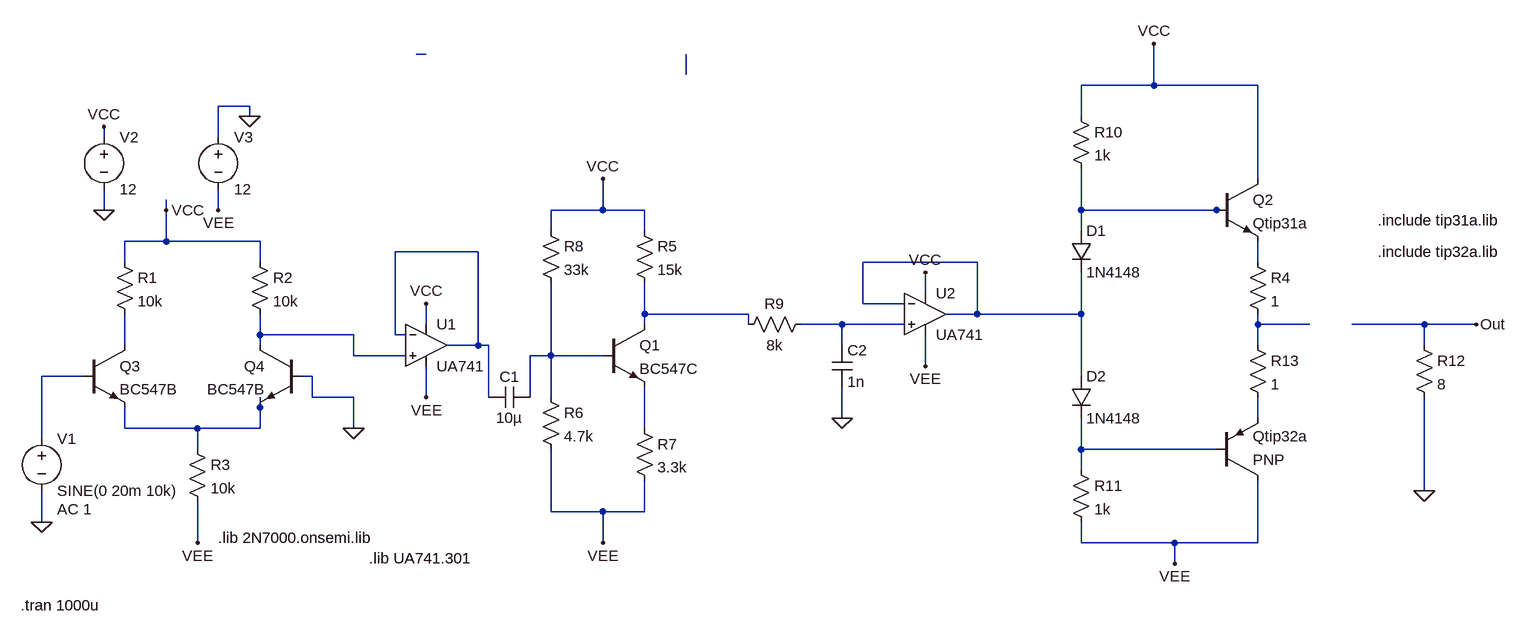
[diagram p0: schematic Audio_amp.asc]
Audio_amp.asc, the LTspice schematic file:
Version 4
SHEET 1 2476 680
WIRE 576 -320 560 -320
WIRE 976 -288 976 -320
WIRE 1696 -272 1696 -336
WIRE 1696 -272 1584 -272
WIRE 1856 -272 1696 -272
WIRE 304 -240 256 -240
WIRE 304 -224 304 -240
WIRE 1584 -224 1584 -272
WIRE 80 -192 80 -208
WIRE 256 -192 256 -240
WIRE 1856 -128 1856 -272
WIRE 80 -80 80 -112
WIRE 176 -80 176 -96
WIRE 256 -80 256 -112
WIRE 848 -80 848 -128
WIRE 848 -80 768 -80
WIRE 912 -80 848 -80
WIRE 1584 -80 1584 -144
WIRE 1792 -80 1584 -80
WIRE 1808 -80 1792 -80
WIRE 768 -48 768 -80
WIRE 912 -48 912 -80
WIRE 1584 -48 1584 -80
WIRE 176 -32 176 -80
WIRE 176 -32 112 -32
WIRE 320 -32 176 -32
WIRE 656 -16 528 -16
WIRE 112 0 112 -32
WIRE 320 0 320 -32
WIRE 1424 0 1248 0
WIRE 1856 0 1856 -32
WIRE 1344 48 1344 16
WIRE 1248 64 1248 0
WIRE 1312 64 1248 64
WIRE 912 80 912 32
WIRE 1072 80 912 80
WIRE 1424 80 1424 0
WIRE 1424 80 1376 80
WIRE 1584 80 1584 16
WIRE 1584 80 1424 80
WIRE 576 96 576 64
WIRE 912 96 912 80
WIRE 1072 96 1072 80
WIRE 1216 96 1152 96
WIRE 1312 96 1216 96
WIRE 1856 96 1856 80
WIRE 1936 96 1856 96
WIRE 2112 96 2000 96
WIRE 2192 96 2112 96
WIRE 320 112 320 80
WIRE 464 112 320 112
WIRE 528 112 528 -16
WIRE 544 112 528 112
WIRE 112 128 112 80
WIRE 320 128 320 112
WIRE 656 128 656 -16
WIRE 656 128 608 128
WIRE 672 128 656 128
WIRE 1216 128 1216 96
WIRE 1856 128 1856 96
WIRE 2112 128 2112 96
WIRE 464 144 464 112
WIRE 544 144 464 144
WIRE 768 144 768 32
WIRE 768 144 736 144
WIRE 848 144 768 144
WIRE 1344 160 1344 112
WIRE 48 176 -16 176
WIRE 400 176 384 176
WIRE 1584 176 1584 80
WIRE 400 208 400 176
WIRE 464 208 400 208
WIRE 576 208 576 160
WIRE 672 208 672 128
WIRE 736 208 736 144
WIRE 768 208 768 144
WIRE 320 224 320 208
WIRE 1216 240 1216 192
WIRE 1856 240 1856 208
WIRE 112 256 112 224
WIRE 224 256 112 256
WIRE 320 256 320 224
WIRE 320 256 224 256
WIRE 464 256 464 208
WIRE 912 256 912 192
WIRE -16 272 -16 176
WIRE 224 288 224 256
WIRE 1584 288 1584 240
WIRE 1792 288 1584 288
WIRE 1584 320 1584 288
WIRE 2112 352 2112 208
WIRE 768 384 768 288
WIRE 848 384 768 384
WIRE 912 384 912 336
WIRE 912 384 848 384
WIRE -16 400 -16 352
WIRE 224 432 224 368
WIRE 848 432 848 384
WIRE 1584 432 1584 400
WIRE 1728 432 1584 432
WIRE 1856 432 1856 336
WIRE 1856 432 1728 432
WIRE 1728 464 1728 432
FLAG 80 -80 0
FLAG 304 -224 0
FLAG 80 -208 VCC
FLAG 256 -80 VEE
FLAG 176 -80 VCC
FLAG 224 432 VEE
FLAG -16 400 0
FLAG 464 256 0
FLAG 848 -128 VCC
FLAG 848 432 VEE
FLAG 1696 -336 VCC
FLAG 1728 464 VEE
FLAG 1216 240 0
FLAG 1344 16 VCC
FLAG 1344 160 VEE
FLAG 576 64 VCC
FLAG 576 208 VEE
FLAG 2192 96 Out
FLAG 2112 352 0
SYMBOL res 96 -16 R0
SYMATTR InstName R1
SYMATTR Value 10k
SYMBOL res 304 -16 R0
SYMATTR InstName R2
SYMATTR Value 10k
SYMBOL res 208 272 R0
SYMATTR InstName R3
SYMATTR Value 10k
SYMBOL voltage -16 256 R0
WINDOW 123 24 124 Left 2
WINDOW 39 0 0 Left 0
SYMATTR Value2 AC 1
SYMATTR InstName V1
SYMATTR Value SINE(0 20m 10k)
SYMBOL voltage 80 -208 R0
SYMATTR InstName V2
SYMATTR Value 12
SYMBOL voltage 256 -208 R0
WINDOW 123 0 0 Left 0
WINDOW 39 0 0 Left 0
SYMATTR InstName V3
SYMATTR Value 12
SYMBOL npn 848 96 R0
SYMATTR InstName Q1
SYMATTR Value BC547C
SYMBOL res 752 192 R0
SYMATTR InstName R6
SYMATTR Value 4.7k
SYMBOL res 896 -64 R0
SYMATTR InstName R5
SYMATTR Value 15k
SYMBOL res 752 -64 R0
SYMATTR InstName R8
SYMATTR Value 33k
SYMBOL res 896 240 R0
SYMATTR InstName R7
SYMATTR Value 3.3k
SYMBOL diode 1568 -48 R0
SYMATTR InstName D1
SYMATTR Value 1N4148
SYMBOL diode 1568 176 R0
SYMATTR InstName D2
SYMATTR Value 1N4148
SYMBOL res 1568 -240 R0
SYMATTR InstName R10
SYMATTR Value 1k
SYMBOL res 1568 304 R0
SYMATTR InstName R11
SYMATTR Value 1k
SYMBOL npn 1792 -128 R0
SYMATTR InstName Q2
SYMATTR Value Qtip31a
SYMBOL pnp 1792 336 M180
SYMATTR InstName PNP
SYMATTR Value Qtip32a
SYMBOL res 1168 80 R90
WINDOW 0 0 56 VBottom 2
WINDOW 3 32 56 VTop 2
SYMATTR InstName R9
SYMATTR Value 8k
SYMBOL cap 1200 128 R0
SYMATTR InstName C2
SYMATTR Value 1n
SYMBOL res 2096 112 R0
SYMATTR InstName R12
SYMATTR Value 8
SYMBOL OpAmps\\opamp2 576 64 R0
SYMATTR InstName U1
SYMATTR Value UA741
SYMBOL cap 736 192 R90
WINDOW 0 0 32 VBottom 2
WINDOW 3 32 32 VTop 2
SYMATTR InstName C1
SYMATTR Value 10µ
SYMBOL OpAmps\\opamp2 1344 16 R0
SYMATTR InstName U2
SYMATTR Value UA741
SYMBOL npn 48 128 R0
SYMATTR InstName Q3
SYMATTR Value BC547B
SYMBOL npn 384 128 M0
SYMATTR InstName Q4
SYMATTR Value BC547B
SYMBOL res 1840 -16 R0
SYMATTR InstName R4
SYMATTR Value 1
SYMBOL res 1840 112 R0
SYMATTR InstName R13
SYMATTR Value 1
TEXT 256 424 Left 2 !.lib 2N7000.onsemi.lib
TEXT 488 456 Left 2 !.lib UA741.301
TEXT -48 528 Left 2 !.tran 1000u
TEXT 2040 -64 Left 2 !.include tip31a.lib
TEXT 2040 -16 Left 2 !.include tip32a.lib

The netlist it stands for:
* Audio_amp.asc
R1 VCC N011 10k
R2 VCC N010 10k
R3 N014 VEE 10k
V1 N013 0 SINE(0 20m 10k) AC 1
V2 VCC 0 12
V3 0 VEE 12
Q1 N007 N012 N016 0 BC547C
R6 N012 VEE 4.7k
R5 VCC N007 15k
R8 VCC N012 33k
R7 N016 VEE 3.3k
D1 N003 N005 1N4148
D2 N005 N017 1N4148
R10 VCC N003 1k
R11 N017 VEE 1k
Q2 VCC N003 N006 0 Qtip31a
Q§PNP VEE N017 N015 0 Qtip32a
R9 N008 N007 8k
C2 N008 0 1n
R12 Out 0 8
XU1 N010 N004 VCC VEE N004 UA741  ; pins In+ In- V+ V- OUT
C1 N012 N004 10µ
XU2 N008 N005 VCC VEE N005 UA741  ; pins In+ In- V+ V- OUT
Q3 N011 N013 N014 0 BC547B
Q4 N010 0 N014 0 BC547B
R4 N006 N009 1
R13 N009 N015 1
.model D D
.lib standard.dio
.model NPN NPN
.model PNP PNP
.lib standard.bjt
.lib 2N7000.onsemi.lib
.lib UA741.301
.tran 1000u
.include tip31a.lib
.include tip32a.lib
.backanno
.end